# EAGLE design Node (EAGLE 7.5.0)
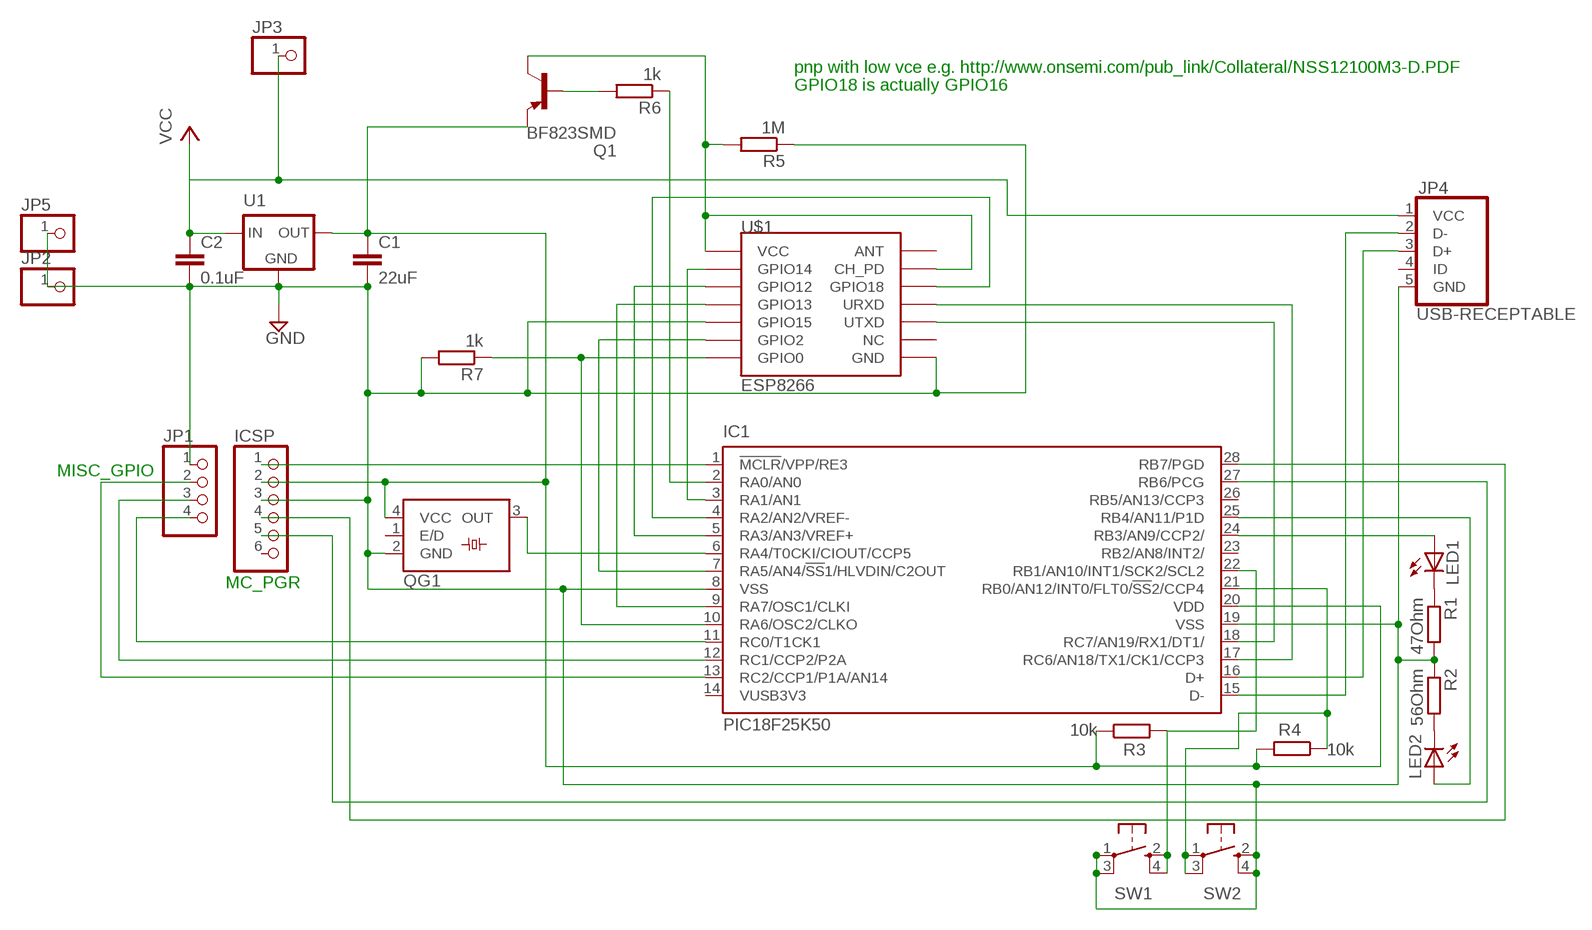
[diagram p0: schematic, sheet 1]

## Parts
C1  22uF  C-EUC0805  [C0805]
C2  0.1uF  C-EUC0805  [C0805]
IC1  PIC18F25K50  PIC18F25K50-I/SO  [SO28W]
ICSP  PINHD-1X6  [1X06]
JP1  PINHD-1X4  [1X04]
JP2  PINHD-1X1  [1X01]
JP3  PINHD-1X1  [1X01]
JP4  USB-RECEPTABLE  [FCI-10103594-0001LF]
JP5  PINHD-1X1  [1X01]
LED1  LEDCHIPLED_0805  [CHIPLED_0805]
LED2  LEDCHIPLED_0805  [CHIPLED_0805]
Q1  BF823SMD  [SOT23-BEC]
QG1  SM77H  [SM77H]
R1  47Ohm  R-EU_M0805  [M0805]
R2  56Ohm  R-EU_M0805  [M0805]
R3  10k  R-EU_M0805  [M0805]
R4  10k  R-EU_M0805  [M0805]
R5  1M  R-EU_M0805  [M0805]
R6  1k  R-EU_M0805  [M0805]
R7  1k  R-EU_M0805  [M0805]
SW1  SPST_TACT-KMR2  [KMR2]
SW2  SPST_TACT-KMR2  [KMR2]
U1  MIC5209-X.XYS  [SOT223]
U$1  ESP8266  [ESP-03]

## Nets
GND: C1.2 C2.2 IC1.8(VSS) IC1.19(VSS) ICSP.3 JP1.1 JP2.1 JP4.5(GND) JP5.1 QG1.2(GND) R1.2 R2.1 R5.1 R7.2 SW1.1(P) SW1.3(P1) SW2.2(S) SW2.4(S1) U1.2(GND) U1.4(GND) U$1.GND U$1.GPIO15
N$1: IC1.28(RB7/PGD) ICSP.4
N$2: C1.1 IC1.20(VDD) ICSP.2 Q1.E QG1.4(VCC) R3.1 R4.2 U1.3(OUT)
N$3: IC1.27(RB6/PCG) ICSP.5
N$4: IC1.2(RA0/AN0) R6.1
N$5: IC1.17(RC6/AN18/TX1/CK1/CCP3) U$1.URXD
N$7: IC1.18(RC7/AN19/RX1/DT1/) U$1.UTXD
N$8: IC1.1(!MCLR!/VPP/RE3) ICSP.1
N$9: IC1.3(RA1/AN1) U$1.GPIO14
N$10: IC1.5(RA3/AN3/VREF+) U$1.GPIO12
N$11: IC1.16(D+) JP4.3(D+)
N$12: IC1.15(D-) JP4.2(D-)
N$13: LED1.C R1.1
N$14: IC1.24(RB3/AN9/CCP2/) LED1.A
N$15: LED2.C R2.2
N$16: IC1.25(RB4/AN11/P1D) LED2.A
N$17: IC1.11(RC0/T1CK1) JP1.4
N$18: IC1.13(RC2/CCP1/P1A/AN14) JP1.2
N$19: IC1.9(RA7/OSC1/CLKI) U$1.GPIO13
N$20: IC1.6(RA4/T0CKI/CIOUT/CCP5) QG1.3(OUT)
N$21: IC1.12(RC1/CCP2/P2A) JP1.3
N$22: IC1.7(RA5/AN4/!SS!1/HLVDIN/C2OUT) U$1.GPIO2
N$23: IC1.4(RA2/AN2/VREF-) U$1.GPIO18
N$24: IC1.10(RA6/OSC2/CLKO) R7.1 U$1.GPIO0
N$25: IC1.22(RB1/AN10/INT1/SCK2/SCL2) R3.2 SW1.2(S) SW1.4(S1)
N$26: IC1.21(RB0/AN12/INT0/FLT0/!SS!2/CCP4) R4.1 SW2.1(P) SW2.3(P1)
N$28: Q1.B R6.2
N$30: Q1.C R5.2 U$1.CH_PD U$1.VCC
VCC: C2.1 JP3.1 JP4.1(VCC) U1.1(IN)
Unconnected: IC1.14(VUSB3V3) IC1.23(RB2/AN8/INT2/) IC1.26(RB5/AN13/CCP3) ICSP.6 JP4.4(ID) QG1.1(E/D) U$1.ANT U$1.NC

## Notes on the sheet
- pnp with low vce e.g. http://www.onsemi.com/pub_link/Collateral/NSS12100M3-D.PDF
- GPIO18 is actually GPIO16
- MISC_GPIO
- MC_PGR

## Library data of the parts
C1 C2 = resistor:C-EU: CAPACITOR, European symbol
IC1 = pic18f25k50:PIC18F25K50: PIC18F25K50 28 pin DIP
ICSP = pinhead:PINHD-1X6: PIN HEADER
JP1 = pinhead:PINHD-1X4: PIN HEADER
JP2 JP3 JP5 = pinhead:PINHD-1X1: PIN HEADER
JP4 = usb:USB-RECEPTABLE: USB Receptable
LED1 LED2 = led:LED: LED OSRAM: - CHIPLED LG R971, LG N971, LY N971, LG Q971, LY Q971, LO R971, LY R971 LH N974, LH R974 LS Q976, LO Q976, LY Q976 LO Q996 - Hyper CHIPLED LW Q18S LB Q993, LB Q99A, LB R99A - SideLED LS A670, LO A670, LY A670, LG A670, LP A670 LB A673, LV A673, LT A673, LW A673 LH A674 LY A675 LS A676, LA A676, LO A676, LY A676, LW A676 LS A679, LY A679, LG A679 - Hyper Micro SIDELED® LS Y876, LA Y876, LO Y876, LY Y876 LT Y87S - SmartLED LW L88C, LW L88S LB L89C, LB L89S, LG L890 LS L89K, LO L89K, LY L89K LS L896, LA L896, LO L896, LY L896 - TOPLED LS T670, LO T670, LY T670, LG T670, LP T670 LSG T670, LSP T670, LSY T670, LOP T670, LYG T670 LG T671, LOG T671, LSG T671 LB T673, LV T673, LT T673, LW T673 LH T674 LS T676, LA T676, LO T676, LY T676, LB T676, LH T676, LSB T676, LW T676 LB T67C, LV T67C, LT T67C, LS T67K, LO T67K, LY T67K, LW E67C LS E67B, LA E67B, LO E67B, LY E67B, LB E67C, LV E67C, LT E67C LW T67C LS T679, LY T679, LG T679 LS T770, LO T770, LY T770, LG T770, LP T770 LB T773, LV T773, LT T773, LW T773 LH T774 LS E675, LA E675, LY E675, LS T675 LS T776, LA T776, LO T776, LY T776, LB T776 LHGB T686 LT T68C, LB T68C - Hyper Mini TOPLED® LB M676 - Mini TOPLED Santana® LG M470 LS M47K, LO M47K, LY M47K Source: http://www.osram.convergy.de LUXEON: - LUMILED® LXK2-PW12-R00, LXK2-PW12-S00, LXK2-PW14-U00, LXK2-PW14-V00 LXK2-PM12-R00, LXK2-PM12-S00, LXK2-PM14-U00 LXK2-PE12-Q00, LXK2-PE12-R00, LXK2-PE12-S00, LXK2-PE14-T00, LXK2-PE14-U00 LXK2-PB12-K00, LXK2-PB12-L00, LXK2-PB12-M00, LXK2-PB14-N00, LXK2-PB14-P00, LXK2-PB14-Q00 LXK2-PR12-L00, LXK2-PR12-M00, LXK2-PR14-Q00, LXK2-PR14-R00 LXK2-PD12-Q00, LXK2-PD12-R00, LXK2-PD12-S00 LXK2-PH12-R00, LXK2-PH12-S00 LXK2-PL12-P00, LXK2-PL12-Q00, LXK2-PL12-R00 Source: www.luxeon.com KINGBRIGHT: KA-3528ASYC Source: www.kingbright.com
Q1 = transistor-pnp:BF823*: PNP Transistror
QG1 = crystal:SM77H: 3.3V CMOS Clock Oscillator Source: www.pletronics.com .. sm77h%203.3v.pdf; OC_FARNELL: unknown; OC_NEWARK: unknown
R1-R7 = resistor:R-EU_: RESISTOR, European symbol
SW1 SW2 = adafruit:SPST_TACT: SMT 6mm switch, EVQQ2 series http://www.ladyada.net/library/eagle
U1 = micrel2:MIC5209-X.XYS: LDO REGULATOR
U$1 = esp8266modules:ESP8266: ESP8266 Wifi module 03 & 04

## Board
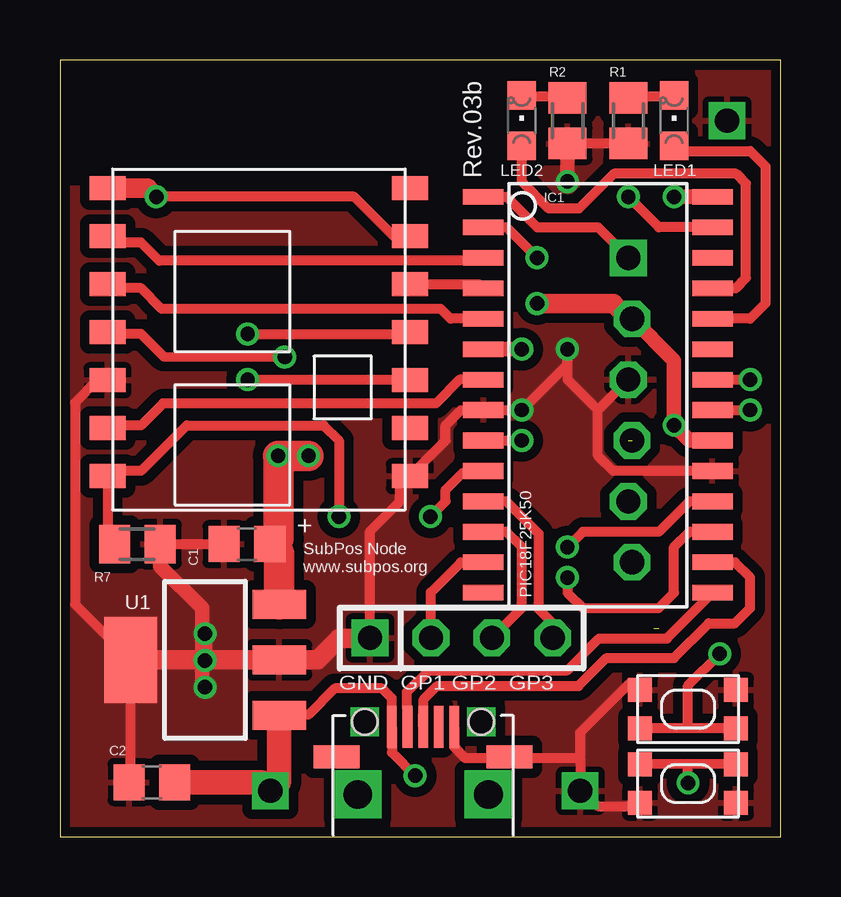
[diagram p1: board, top side]
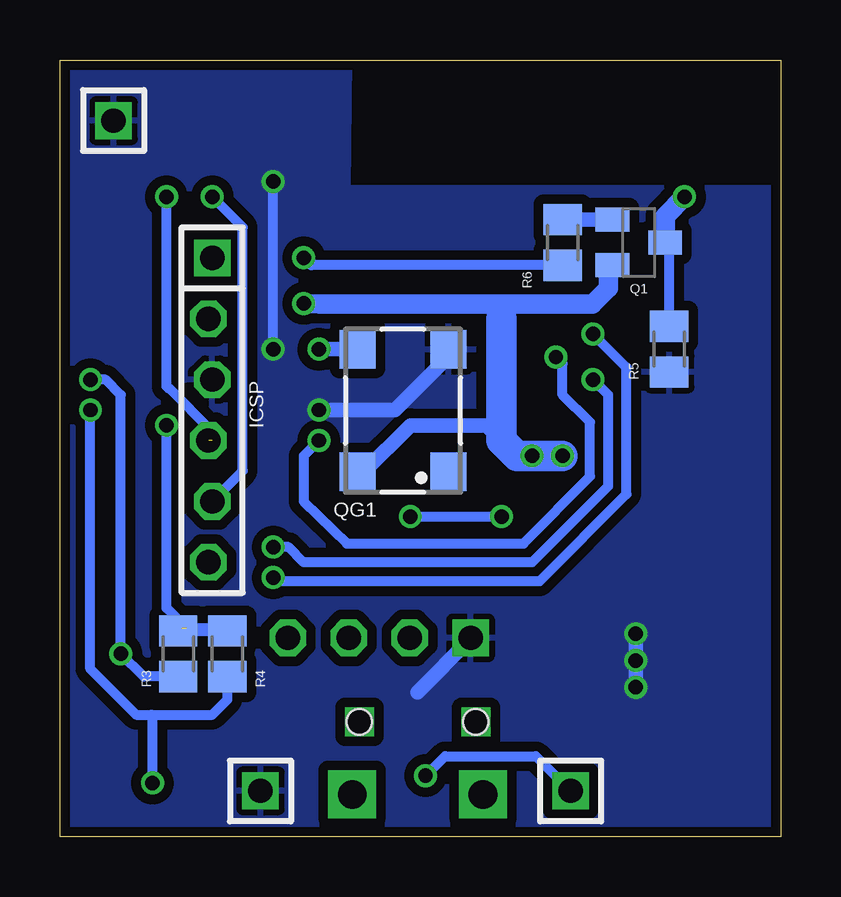
[diagram p2: board, bottom side, seen from below]

Size 30.05 x 32.38 mm. Coordinates in mm from the lower left corner, seen from the top.
Outline: 0,0 30.05,0 30.05,32.38 0,32.38 0,0
Copper layers (1*16): Top 0.0356mm / dielectric 1.5011mm / Bottom 0.0356mm
Design rules "oshpark-2layer": minimum track width 6mil, minimum drill 13mil, track to track 6mil, track to pad 6mil, pad to pad 6mil, via to via 6mil, smd to smd 6mil, copper to edge 15mil, drill to drill 6mil, minimum pad ring 7mil, minimum via ring 7mil, stop-mask expansion 4mil, vias tented up to drill 0mil, thermal gap 10mil

### Footprints (pad centres in the part's own frame; a part is rotated, then mirrored left to right if it is on the bottom)
C0805 = smd 1.3 x 1.5: 1 -0.95,0; 2 0.95,0
SO28W = smd 0.65 x 1.7: 1 -7.62,-4.78; 2 -6.35,-4.78; 3 -5.08,-4.78; 4 -3.81,-4.78; 5 -2.54,-4.78; 6 -1.27,-4.78; 7 0,-4.78; 8 1.27,-4.78; 9 2.54,-4.78; 10 3.81,-4.78; 11 5.08,-4.78; 12 6.35,-4.78; 13 7.62,-4.78; 14 8.89,-4.78; 15 8.89,4.78; 16 7.62,4.78; 17 6.35,4.78; 18 5.08,4.78; 19 3.81,4.78; 20 2.54,4.78; 21 1.27,4.78; 22 0,4.78; 23 -1.27,4.78; 24 -2.54,4.78; 25 -3.81,4.78; 26 -5.08,4.78; 27 -6.35,4.78; 28 -7.62,4.78
1X06 = drill 1.016 square: 1 -6.35,0 | drill 1.016 octagon: 2 -3.81,0.159; 3 -1.27,0; 4 1.27,0.159; 5 3.81,0; 6 6.35,0.159
1X04 = drill 1.016 square: 1 -3.81,0 | drill 1.016 octagon: 2 -1.27,0; 3 1.27,0; 4 3.81,0
1X01 = drill 1.016 square: 1 0,0
FCI-10103594-0001LF = smd 0.4 x 1.75: 1 -1.3,4.525; 2 -0.65,4.525; 3 0,4.525; 4 0.65,4.525; 5 1.3,4.525 | drill 0.8 square: P$1 -2.429,4.735; P$2 2.425,4.735 | drill 1.2 pad 2 square: P$3 -2.725,1.7; P$4 2.725,1.7 | smd 1.93 x 0.965: P$5 -3.606,3.277; P$6 3.602,3.268 | hole 1.05: -2.425,4.73; 2.425,4.73
CHIPLED_0805 = smd 1.2 x 1.2: A 0,-1.05; C 0,1.05
SOT23-BEC = smd 1 x 1.4: B -0.95,-1.1; C 0,1.1; E 0.95,-1.1
SM77H = smd 1.6 x 1.5: 1 -2.55,-1.9; 2 2.55,-1.9; 3 2.55,1.9; 4 -2.55,1.9
M0805 = smd 1.3 x 1.6: 1 -0.95,0; 2 0.95,0
KMR2 = smd 1 x 1: 1 2,0.8; 2 2,-0.8; 3 -2,0.8; 4 -2,-0.8
SOT223 = smd 1.219 x 2.235: 1 -2.311,-3.099; 2 0,-3.099; 3 2.311,-3.099 | smd 3.6 x 2.2: 4 0,3.099
ESP-03 = smd 1.5 x 1: ANT 7.4,4.8; CH_PD 7.4,2.8; GND 7.4,-7.2; GPIO0 -5.2,-7.2; GPIO2 -5.2,-5.2; GPIO12 -5.2,0.8; GPIO13 -5.2,-1.2; GPIO14 -5.2,2.8; GPIO15 -5.2,-3.2; GPIO18 7.4,0.8; NC 7.4,-5.2; URXD 7.4,-1.2; UTXD 7.4,-3.2; VCC -5.2,4.8

### Placement (x,y rotation side)
C1  7.8,12.19 180 top
C2  3.84,2.26 180 top
IC1  22.43,19.05 270 top
ICSP  23.7,17.78 270 top
JP1  16.74,8.28 0 top
JP2  27.81,29.84 0 bottom
JP3  8.76,1.91 0 bottom
JP4  15.14,0.05 0 top
JP5  21.69,1.91 0 bottom
LED1  25.6,29.84 0 top
LED2  19.25,29.84 0 top
Q1  5.92,24.77 270 bottom
QG1  15.75,17.75 90 bottom
R1  23.7,29.84 270 top
R2  21.16,29.84 90 top
R3  25.12,7.62 270 bottom
R4  23.06,7.62 90 bottom
R5  4.65,20.32 90 bottom
R6  9.09,24.77 90 bottom
R7  3.23,12.19 0 top
SW1  26.19,5.31 0 top
SW2  26.19,2.21 0 top
U1  6.05,7.37 90 top
U$1  7.19,22.23 0 top

### Tracks (layer width: path | path; a pad name or v marks a point on that pad's centre or on a via)
GND  (via drill 0.6)
  Top 0.254: 21.34,28.88 R2.1 | 23.62,28.88 R1.2 23.8,28.85
  Top 0.406: 23.62,28.88 21.34,28.88 | IC1.19 23.06,15.24 22.43,15.88 22.43,17.78 | ICSP.3 22.43,17.78 | 21.69,3.28 JP5.1 21.79,1.91 22.43,1.27 24.05,1.27 SW2.4 | C2.2 2.95,2.26 U1.4 0.64,9.68 0.64,18.09 1.55,19.02 U$1.GPIO15 | 21.69,3.28 16.89,3.28 16.44,3.73 JP4.5 | JP1.1 12.93,12.73 14.17,13.97 14.17,14.61 U$1.GND 16.08,16.51 16.08,17.15 16.71,17.78 IC1.8 v19.25,17.78 21.16,19.69 v21.16,20.32 21.16,19.05 22.43,17.78 | R7.2 C1.2 | 21.69,3.28 21.69,4.34 23.7,6.35 23.95,6.35 SW1.3
  Top 0.61: R2.1 v21.16,27.3 | v6.05,7.34 v6.05,8.46 | R7.2 4.18,11.27 5.92,9.52 5.92,6.35 v6.05,6.22
  Top 0.813: JP1.1 12.9,8.25 11.63,8.25 10.74,7.37 U1.2 U1.4
  Bottom 0.406: 21.19,20.29 v21.16,20.32 v21.16,27.3
  Bottom 0.61: JP1.1 12.93,8.23 15.14,6.02 | v6.05,8.46 v6.05,6.22 | QG1.2 13.55,20.3 16.08,17.78 v19.25,17.78
  pour Bottom (isolate 0.406): 0.25,27.03 18.03,27.03 17.98,32.38 30.05,32.38 30.05,0 0.2,0
  pour Top (isolate 0.406): 0.25,27.03 18.01,27.03 17.98,32.38 30.05,32.38 30.05,0 0.2,0
  pour Bottom (isolate 0.406): 0.25,27.03 18.03,27.03 17.98,32.38 30.05,32.38 30.05,0 0.2,0
  pour Bottom (isolate 0.406): 0.25,27.03 18.03,27.03 17.98,32.38 30.05,32.38 30.05,0 0.2,0
  pour Bottom (isolate 0.406): 0.25,27.03 18.03,27.03 17.98,32.38 30.05,32.38 30.05,0 0.2,0
N$1  (via drill 0.6)  (1 unrouted)
  Top 0.61: IC1.28 v25.6,26.67
  Bottom 0.406: v25.6,26.67 25.6,18.77 25.53,18.69 25.5,18.69 23.7,16.89 23.7,16.51
N$2  (via drill 0.6)  (1 unrouted)
  Top 0.61: IC1.20 26.24,16.51 v25.6,17.15 25.6,19.84 ICSP.2
  Top 0.813: ICSP.2 23.7,21.59 23.06,22.23 v19.89,22.23
  Top 1.016: 9.14,11.8 C1.1 8.89,12.19 9.12,12.42
  Top 1.27: v10.36,15.88 v9.09,15.88 9.12,15.85 9.12,12.42 | U1.3 9.14,11.8
  Bottom 0.406: R4.2 R3.1 24.97,8.69 | 23.27,8.69 24.77,8.69 25.6,9.52 v25.6,17.15
  Bottom 0.61: QG1.4 17.38,15.2 15.44,17.15 12.27,17.15 11.63,16.51
  Bottom 0.813: Q1.E 7.19,23.65 7.19,22.86 7.85,22.2 11.63,22.2 | 11.63,22.2 19.23,22.2 v19.89,22.23 | 11.63,21.59 11.63,22.2
  Bottom 1.27: v9.09,15.88 v10.36,15.88 11,15.88 11.63,16.51 11.63,21.59
N$3  (via drill 0.6)
  Top 0.406: IC1.27 24.97,25.4 v23.7,26.67
  Bottom 0.406: ICSP.5 22.43,15.24 22.43,25.4 v23.7,26.67
N$4  (via drill 0.6)
  Top 0.406: IC1.2 18.62,25.4 v19.89,24.13
  Bottom 0.406: R6.1 19.57,23.81 v19.89,24.13
N$5  (via drill 0.6)
  Top 0.406: v7.82,20.95 14.52,20.95 U$1.URXD | IC1.17 26.24,12.7 25.6,12.06 25.6,10.16 24.97,9.52 21.79,9.52 21.16,10.16 v21.16,10.8
  Bottom 0.406: v21.16,10.8 21.01,10.64 10.06,10.64 6.43,14.27 6.43,19.56 v7.82,20.95
N$7  (via drill 0.6)
  Top 0.406: IC1.18 26.24,13.97 24.97,12.7 21.79,12.7 v21.16,12.06 | v7.82,19.05 14.56,19.05 U$1.UTXD
  Bottom 0.406: v21.16,12.06 20.52,12.06 19.89,11.43 10.36,11.43 7.19,14.61 7.19,18.41 v7.82,19.05
N$8
  Top 0.406: IC1.1 18.62,26.67 19.89,25.4 22.43,25.4 ICSP.1
N$9
  Top 0.406: IC1.3 17.12,24.13 16.99,24 4.14,24 3.38,24.77 2.25,24.77 U$1.GPIO14
N$10
  Top 0.406: IC1.5 16.28,21.59 15.88,22 4.24,22 3.38,22.86 2.15,22.86 U$1.GPIO12
N$11
  Top 0.406: JP4.3 15.16,5.71 15.72,6.27 21.62,6.27 22.78,7.44 25.6,7.44 27.05,8.89 28.14,8.89 28.78,9.52 28.78,10.8 28.14,11.43 IC1.16
N$12
  Top 0.406: JP4.2 14.46,6.03 15.39,6.93 21.16,6.93 22.48,8.25 25.3,8.25 IC1.15
N$13
  Top 0.254: 25.4,30.86 LED1.C | 23.8,30.86 R1.1
  Top 0.406: 23.8,30.86 25.4,30.86
N$14
  Top 0.406: LED1.A 25.6,28.58 28.78,28.58 29.41,27.94 29.41,22.23 28.78,21.59 IC1.24
N$15
  Top 0.254: 19.48,30.84 LED2.C | 21.08,30.84 R2.2
  Top 0.406: 21.08,30.84 19.48,30.84
N$16
  Top 0.254: 19.23,28.85 LED2.A
  Top 0.406: IC1.25 28.17,22.86 28.6,23.29 28.6,27.23 28.19,27.63 23.09,27.63 21.64,26.19 20.37,26.19 19.25,27.3 LED2.A
N$17
  Top 0.406: JP1.4 20.55,8.89 19.96,9.47 19.96,12.62 18.62,13.97 IC1.11
N$18
  Top 0.406: JP1.2 15.47,10.19 16.71,11.43 IC1.13
N$19  (via drill 0.6)
  Top 0.406: U$1.GPIO13 2.06,20.95 3.38,20.95 4.32,20.02 v9.37,19.99 | IC1.9 v19.25,16.51
  Bottom 0.406: v19.25,16.51 19.89,15.88 19.89,13.97 18.09,12.22 10.72,12.22 7.95,15.01 7.95,17.27 9.09,18.41 9.09,19.71 v9.37,19.99
N$20  (via drill 0.6)
  Top 0.61: IC1.6 v19.25,20.32
  Bottom 0.61: v19.25,20.32 IC1.6 QG1.3
N$21
  Top 0.406: JP1.3 19.25,9.52 19.25,12.06 18.62,12.7 IC1.12
N$22
  Top 0.406: IC1.7 16.66,19.05 15.67,18.06 4.29,18.06 3.38,17.15 2.11,17.15 U$1.GPIO2
N$23
  Top 0.406: U$1.GPIO18 17.48,23.02 IC1.4
N$24  (via drill 0.6)
  Top 0.406: 17.57,15.16 IC1.10 16.76,15.14 16.08,14.45 16.08,13.97 v15.44,13.34 | v11.63,13.34 11.63,16.51 11,17.15 5.28,17.15 3.38,15.24 2.2,15.24 U$1.GPIO0 1.99,12.48 R7.1
  Bottom 0.406: v15.44,13.34 v11.63,13.34
N$25  (via drill 0.6)
  Top 0.406: IC1.22 v28.78,19.05 | SW1.2 SW1.4 26.19,4.52 26.19,6.3 v27.51,7.62
  Bottom 0.406: v28.78,19.05 28.14,19.05 27.51,18.41 v27.51,7.62 26.56,6.67 R3.2
N$26  (via drill 0.6)
  Top 0.406: IC1.21 v28.78,17.78 | v26.19,2.23 26.19,3.02 | 26.19,3.02 SW2.3 | SW2.1 26.19,3.02
  Bottom 0.406: v28.78,17.78 28.78,6.98 26.87,5.08 26.24,5.08 | 26.24,5.08 23.7,5.08 23.06,5.71 R4.1 | v26.19,2.23 26.19,5.03 26.24,5.08
N$28
  Bottom 0.61: Q1.B R6.2
N$30  (via drill 0.6)
  Top 0.406: U$1.CH_PD 13.91,25.02 12.27,26.67 v4.01,26.67
  Top 0.813: U$1.VCC 3.66,27.02 v4.01,26.67
  Bottom 0.406: R5.2 4.65,24.59 Q1.C
  Bottom 0.813: Q1.C 4.82,25.87 v4.01,26.67
N$31  (via drill 0.6)
  other vias: 19.25,20.32
VCC  (via drill 0.6)
  Top 0.406: v14.81,2.54 13.84,3.51 JP4.1 13.84,5.77 13.44,6.17 11.46,6.17 10.36,5.08 9.09,5.08
  Top 1.016: C2.1 8.41,2.26 JP3.1 9.14,2.29 U1.1
  Bottom 0.406: v14.81,2.54 14,3.35 10.21,3.35 JP3.1

### Text on the board
tNames: Rev.03b | + | SubPos Node / www.subpos.org | GND GP1 GP2 GP3